# EasyEDA Pro project 3轴5.2_-专业软件格式.eprj, board 3轴5.2-PCB-V3.3
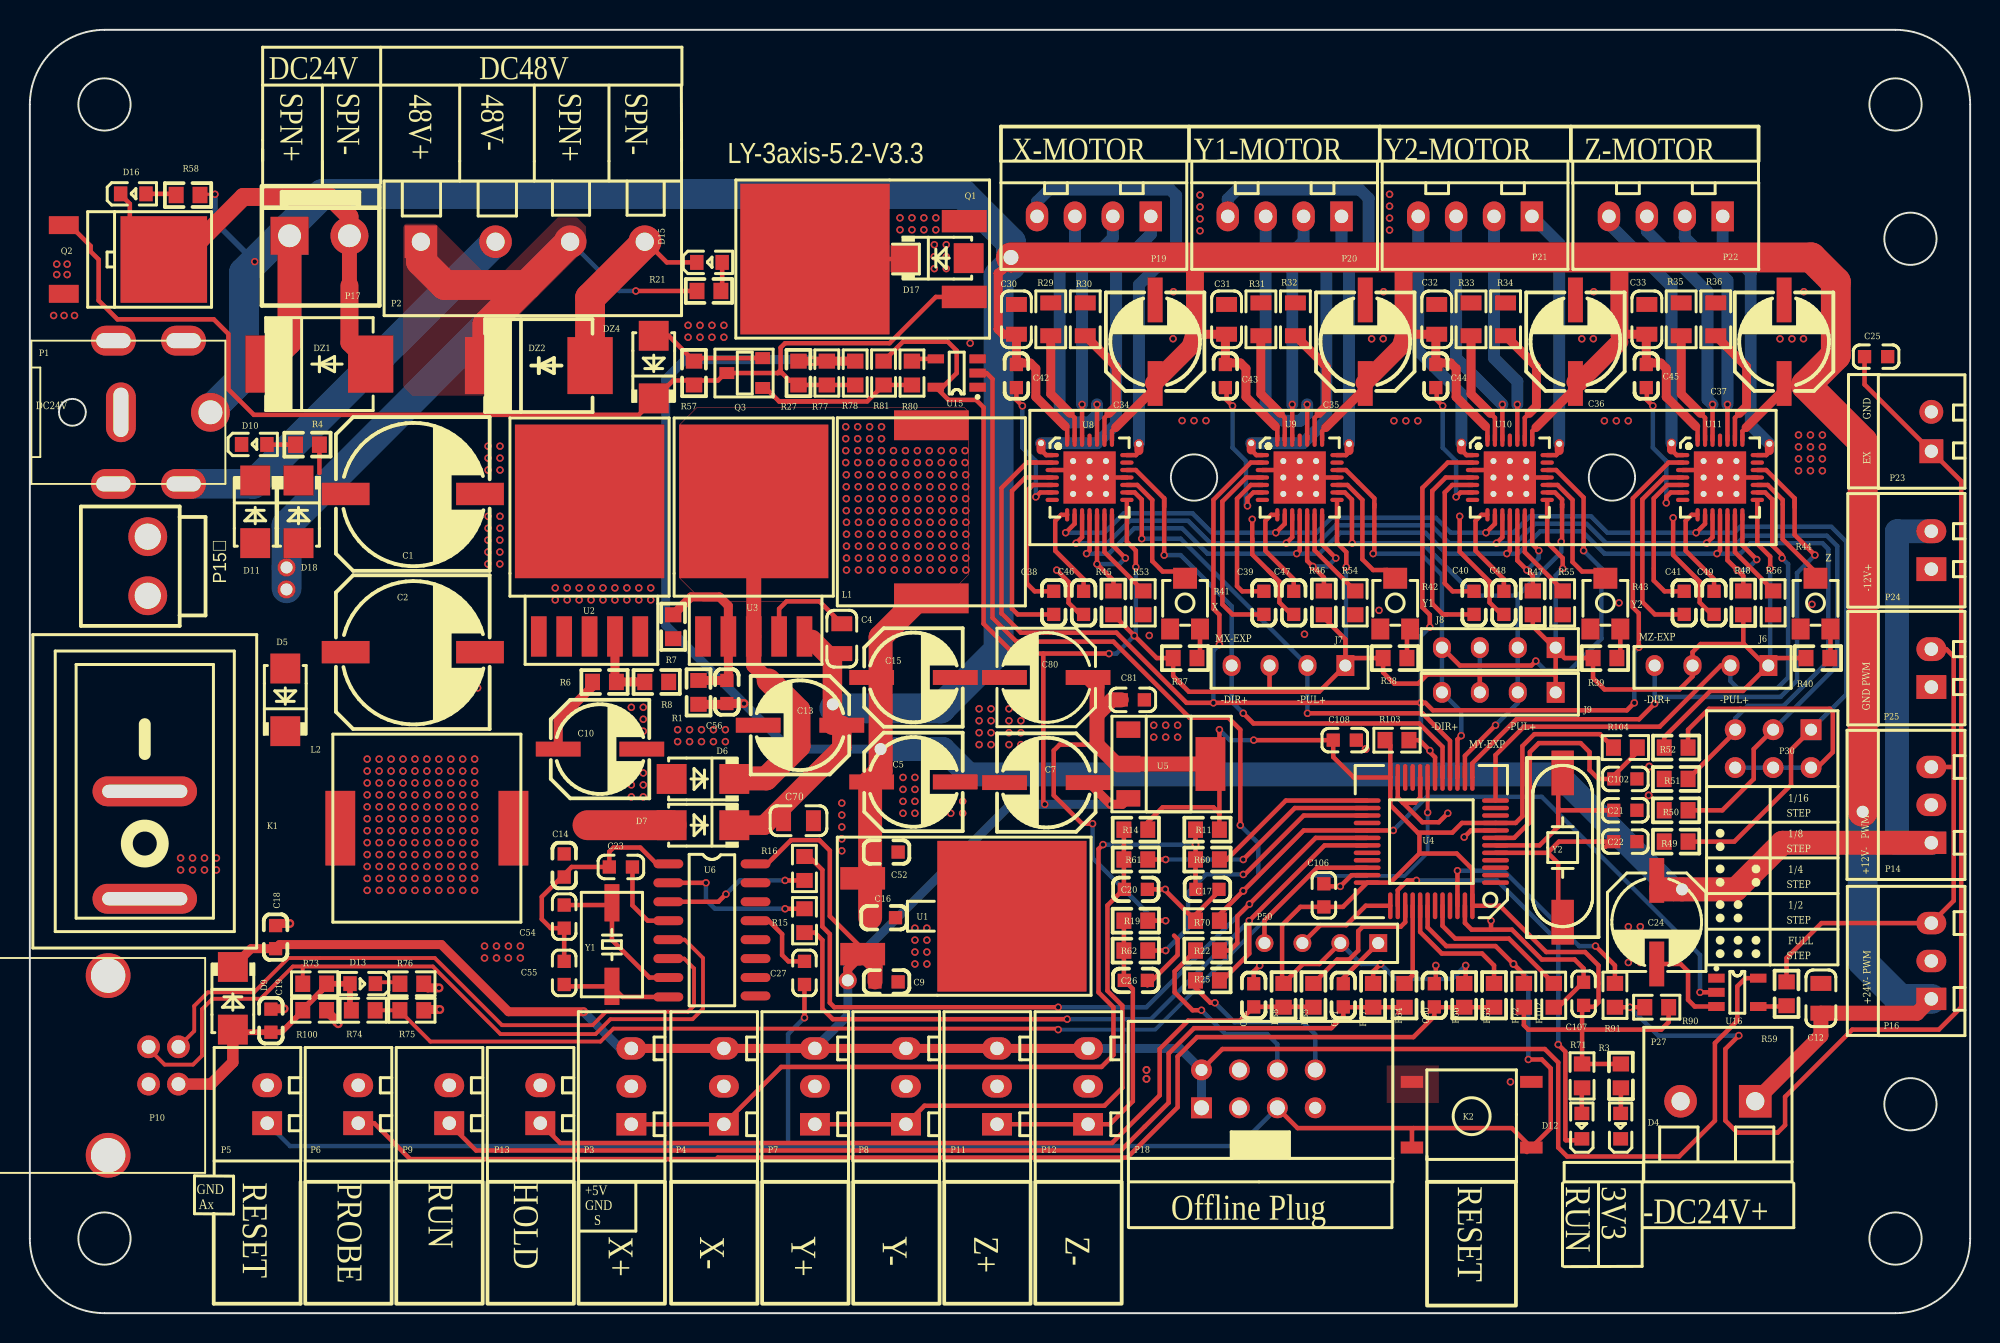
[diagram p2: board, top side]
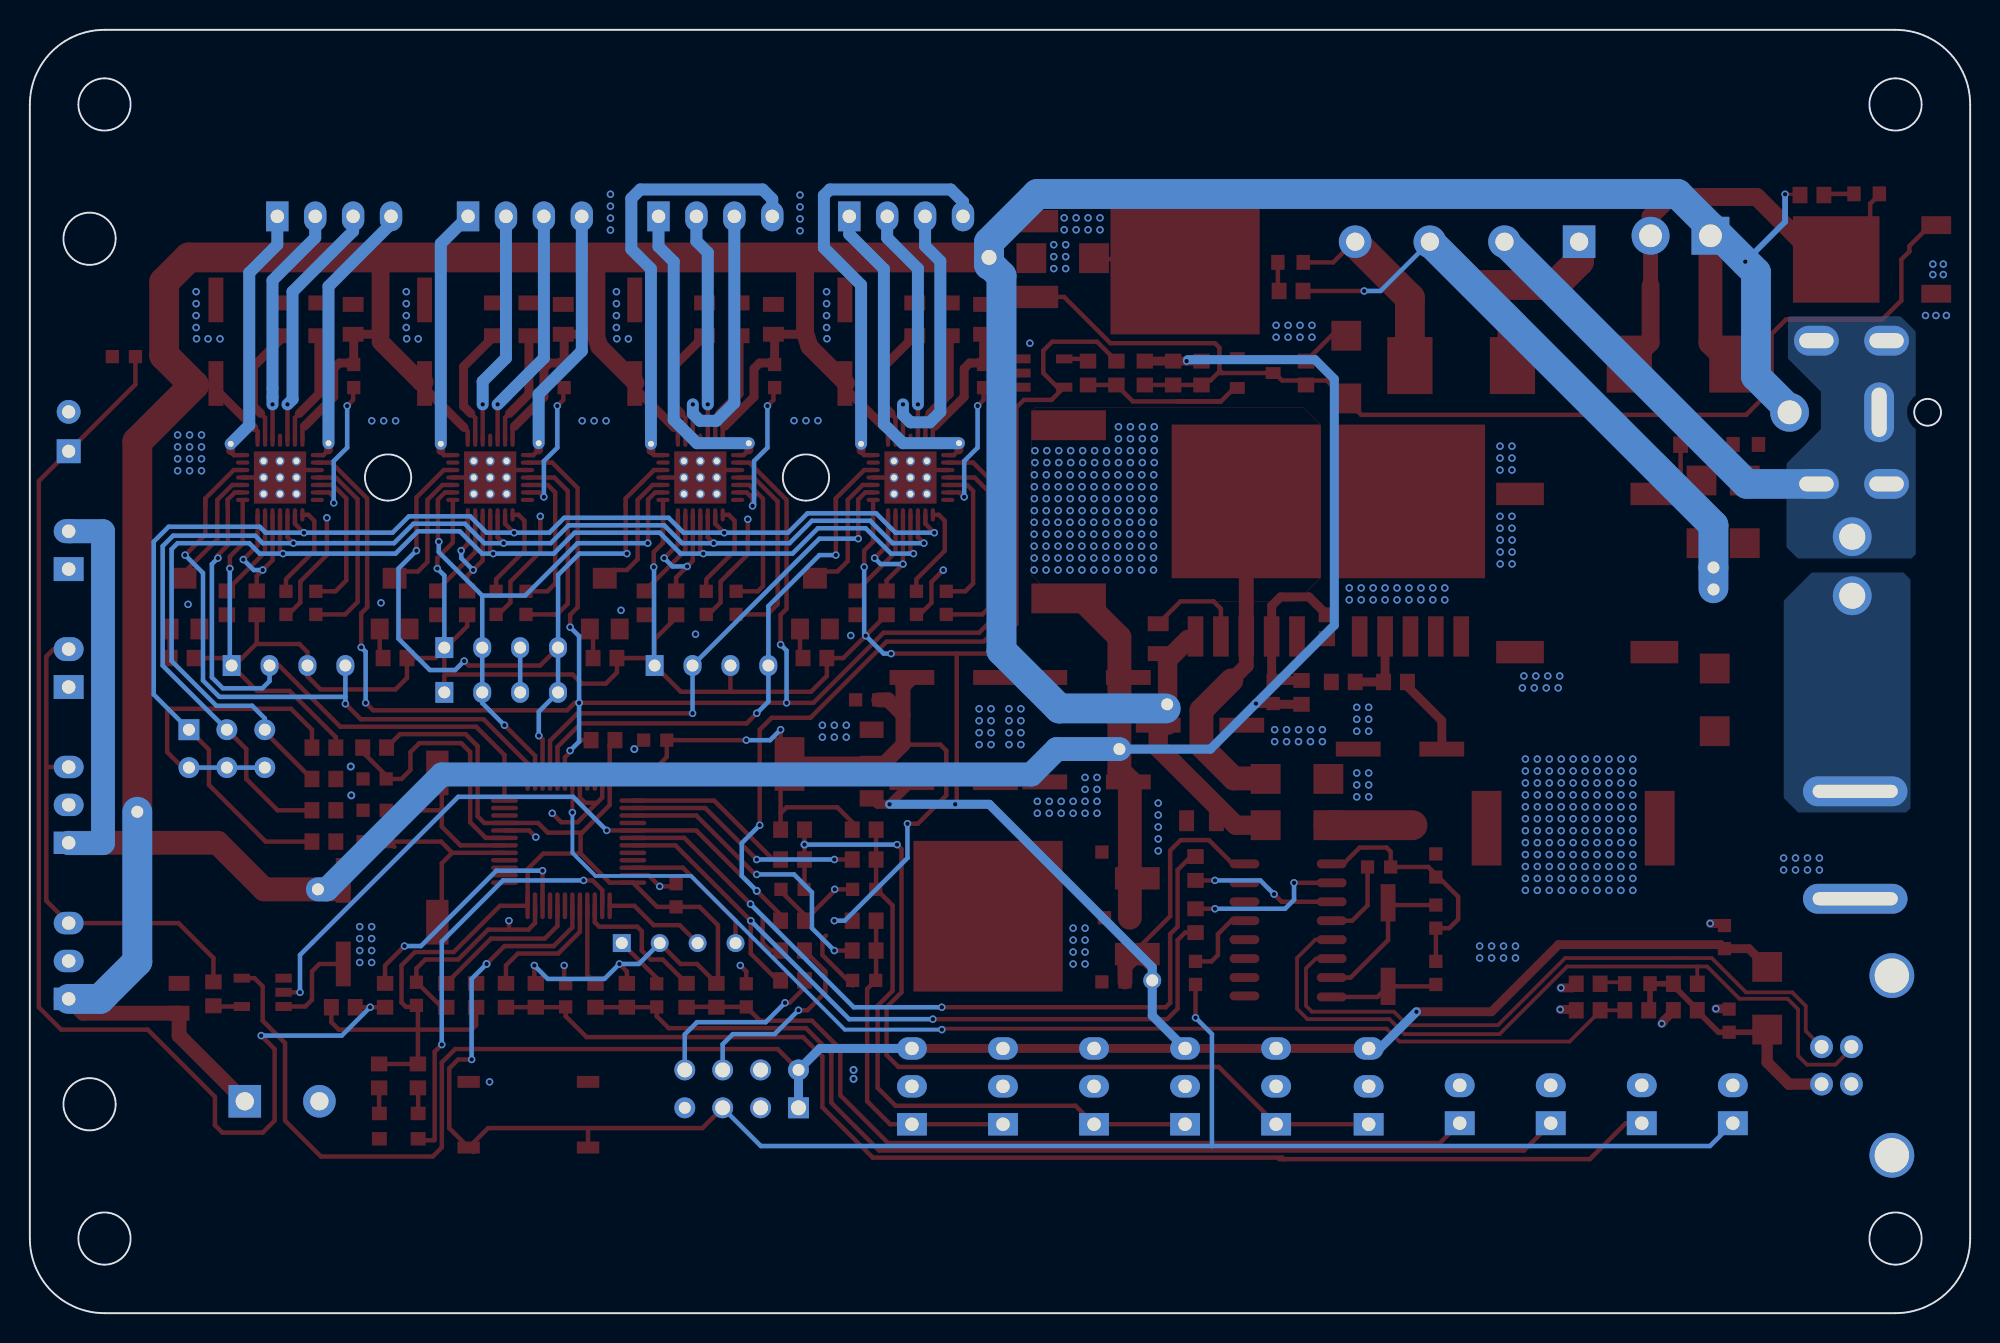
[diagram p3: board, bottom side, seen from below]

Outline 130 x 86 mm; copper layers: Top Layer, Bottom Layer. Coordinates in mm from the lower left corner of the outline.
Outline path: circle c5,81 r1.75 ; circle c5,5 r1.75 ; circle c78,56 r1.55 ; circle c106,56 r1.55 ; circle c125,81 r1.75 ; circle c125,5 r1.75 ; circle c126,72 r1.75 ; circle c126,14 r1.75 ; 0,81 0,5 arc(1.46,1.46) 5,0 125,0 arc(128.54,1.46) 130,5 130,81 arc(128.54,84.54) 125,86 5,86 arc(1.46,84.54) 0,81
Stack: Top Layer 0.0356mm / Dielectric1 0.32mm FR-4 er 4.8 / Bottom Layer 0.0356mm

## Design rules (mm)
net C24: Top Side Components
net R91: Top Side Components
net R90: Top Side Components
net P23: Top Side Components
net C25: Top Side Components
net R78: Top Side Components
net R77: Top Side Components
net D17: Top Side Components
net R56: Top Side Components
net R55: Top Side Components
net R54: Top Side Components
net R53: Top Side Components
net U16: Top Side Components
net U15: Top Side Components
net R104: Top Side Components
net R103: Top Side Components
net R102: Top Side Components
net R75: Top Side Components
net R74: Top Side Components
net R73: Top Side Components
net R72: Top Side Components
net R71: Top Side Components
net R70: Top Side Components
net P50: Top Side Components
net D4: Top Side Components
net C108: Top Side Components
net C107: Top Side Components
net C106: Top Side Components
net C22: Top Side Components
net C21: Top Side Components
net C102: Top Side Components
net C81: Top Side Components
net C80: Top Side Components
net C70: Top Side Components
net Y2: Top Side Components
net C52: Top Side Components
net C1: Top Side Components
net C2: Top Side Components
net C4: Top Side Components
net C5: Top Side Components
net C7: Top Side Components
net C9: Top Side Components
net C10: Top Side Components
net C12: Top Side Components
net C13: Top Side Components
net C14: Top Side Components
net C15: Top Side Components
net C16: Top Side Components
net C17: Top Side Components
net C18: Top Side Components
net C19: Top Side Components
net C20: Top Side Components
net C26: Top Side Components
net C30: Top Side Components
net C31: Top Side Components
net C32: Top Side Components
net C33: Top Side Components
net C34: Top Side Components
net C35: Top Side Components
net C36: Top Side Components
net C37: Top Side Components
net C38: Top Side Components
net C39: Top Side Components
net C40: Top Side Components
net C41: Top Side Components
net C42: Top Side Components
net C43: Top Side Components
net C44: Top Side Components
net C45: Top Side Components
net C46: Top Side Components
net C47: Top Side Components
net C48: Top Side Components
net C49: Top Side Components
net D5: Top Side Components
net D6: Top Side Components
net D7: Top Side Components
net D9: Top Side Components
net D10: Top Side Components
net D12: Top Side Components
net D13: Top Side Components
net D15: Top Side Components
net DZ1: Top Side Components
net DZ2: Top Side Components
net P24: Top Side Components
net P25: Top Side Components
net J6: Top Side Components
net J7: Top Side Components
net J8: Top Side Components
net K1: Top Side Components
net K2: Top Side Components
net L1: Top Side Components
net L2: Top Side Components
net P2: Top Side Components
net P3: Top Side Components
net P4: Top Side Components
net P5: Top Side Components
net P6: Top Side Components
net P7: Top Side Components
net P8: Top Side Components
net P9: Top Side Components
net P11: Top Side Components
net P12: Top Side Components
net P13: Top Side Components
net P14: Top Side Components
net P16: Top Side Components
net P17: Top Side Components
net P18: Top Side Components
net P19: Top Side Components
net P20: Top Side Components
net P21: Top Side Components
net P22: Top Side Components
net Q1: Top Side Components
net Q2: Top Side Components
net R1: Top Side Components
net R3: Top Side Components
net R4: Top Side Components
net R6: Top Side Components
net R7: Top Side Components
net R8: Top Side Components
net R11: Top Side Components
net R14: Top Side Components
net R19: Top Side Components
net R21: Top Side Components
net R22: Top Side Components
net R25: Top Side Components
net R27: Top Side Components
net R29: Top Side Components
net R30: Top Side Components
net R31: Top Side Components
net R32: Top Side Components
net R33: Top Side Components
net R34: Top Side Components
net R35: Top Side Components
net R36: Top Side Components
net R37: Top Side Components
net R38: Top Side Components
net R39: Top Side Components
net R40: Top Side Components
net R41: Top Side Components
net R42: Top Side Components
net R43: Top Side Components
net R44: Top Side Components
net R45: Top Side Components
net R46: Top Side Components
net R47: Top Side Components
net R48: Top Side Components
net R49: Top Side Components
net R50: Top Side Components
net R51: Top Side Components
net R52: Top Side Components
net U1: Top Side Components
net U2: Top Side Components
net U3: Top Side Components
net U4: Top Side Components
net U5: Top Side Components
net U8: Top Side Components
net U9: Top Side Components
net U10: Top Side Components
net U11: Top Side Components
net D16: Top Side Components
net DZ4: Top Side Components
net R57: Top Side Components
net R58: Top Side Components
net R59: Top Side Components
net J9: Top Side Components
net P27: Top Side Components
net C56: Top Side Components
net D11: Top Side Components
net P1: Top Side Components
net D18: Top Side Components
net C60: Top Side Components
net C61: Top Side Components
net C62: Top Side Components
net R60: Top Side Components
net R61: Top Side Components
net R62: Top Side Components
net R63: Top Side Components
net R64: Top Side Components
net R65: Top Side Components
net R66: Top Side Components
net R67: Top Side Components
net R68: Top Side Components
net P30: Top Side Components
net C23: Top Side Components
net C27: Top Side Components
net C54: Top Side Components
net C55: Top Side Components
net Q3: Top Side Components
net R15: Top Side Components
net R16: Top Side Components
net R80: Top Side Components
net R81: Top Side Components
net U6: Top Side Components
net Y1: Top Side Components
net R100: Top Side Components
net P10: Top Side Components
net P15: Top Side Components
net R76: Top Side Components
spacing Clearance (default): track to track 0.178, other pairs 0.178 to 0.178
spacing Polygon: track to track 0.508, other pairs 0.508 to 0.508
track width Width (default): min 0.01, default 0.254, max 5
differential pair DiffPairsRouting (default): width min 0.381, default 0.381, max 0.381; gap min 0.254, default 0.254
via RoutingVias (default): diameter min 0.3, default 0.8, max 1.27; hole min 0.3, default 0.6, max 2

## Placement (name value [footprint] x y rotation side)
C1  104  [电解电容贴片10x10]  25.4 54.8 0 top
C2  104  [电解电容贴片10x10]  25.4 44.2 0 top
C4  104  [0805C]  54.4 45.2 270 top
C5  18pF  [电解电容贴片6X6]  59.2 35.6 0 top
C7  104  [电解电容贴片6X6]  68.1 35.56 180 top
C9  100pF  [0603C]  57.4 22.2 180 top
C10  103  [电解电容贴片6X6]  38.2 37.8 0 top
C12  103  [0805C]  120 21.1 90 top
C13  103  [电解电容贴片6X6]  51.6 39.4 180 top
C14  104  [0603C]  35.8 30 90 top
C15  104  [电解电容贴片6X6]  59.2 42.6 0 top
C16  104  [0603C]  57.23 26.5 180 top
C17  103?  [0603C]  78.9 28.4 180 top
C18  104  [0603C]  16.46 25.2 270 top
C19  103  [0603C]  16.15 19.6 270 top
C20  103  [0603C]  74.1 28.4 180 top
C21  104  [0603C]  106.9 33.7 0 top
C22  100uF/35V  [0603C]  106.9 31.6 0 top
C23  100uF/35V  [0603C]  39.6 29.9 180 top
C24  104  [电解电容贴片6x6]  109 26.2 270 top
C25  100uF/35V  [0603C]  123.7 64.1 180 top
C26  100uF/35V  [0603C]  74.1 22.3 180 top
C27  100uF/35V  [0603C]  51.9 22.8 270 top
C30  100uF/35V  [0805C]  66.1 66.6 90 top
C31  100uF/63V  [0805C]  80.18 66.6 90 top
C32  100uF/63V  [0805C]  94.26 66.6 90 top
C33  100uF/35V  [0805C]  108.34 66.6 90 top
C34  105  [电解电容贴片6X6]  75.39 65.1 90 top
C35  104  [电解电容贴片6X6]  89.47 65.1 90 top
C36  105  [电解电容贴片6X6]  103.55 65.1 90 top
C37  100uF/35V  [电解电容贴片6X6]  117.53 65.1 90 top
C38  105  [0603C]  68.6 47.6 90 top
C39  33nF  [0603C]  82.68 47.6 90 top
C40  100uF/35V  [0603C]  96.76 47.6 90 top
C41  104  [0603C]  110.84 47.6 90 top
C42  100uF/35V  [0603C]  66.1 62.8 90 top
C43  104  [0603C]  80.1 62.8 90 top
C44  100uF/35V  [0603C]  94.2 62.8 90 top
C45  104  [0603C]  108.3 62.8 90 top
C46  104  [0603C]  70.6 47.6 270 top
C47  104  [0603C]  84.68 47.6 270 top
C48  100uF/35V  [0603C]  98.76 47.6 270 top
C49  100uF/35V  [0603C]  112.84 47.6 270 top
C52  104  [0603C]  57.4 30.9 180 top
C54  33pF  [0603C]  35.8 26.57 270 top
C55  33pF  [0603C]  35.8 22.8 90 top
C56  33nF  [0603C]  46.7 41.63 270 top
C60  103  [0603C]  94.1 21.3 270 top
C61  103  [0603C]  88 21.3 270 top
C62  103  [0603C]  82 21.3 270 top
C70  105  [0805C]  51.5 33 0 top
C80  100uF/35V  [电解电容贴片6x6]  68.1 42.6 180 top
C81  104  [0603C]  73.9 41.1 180 top
C102  104  [0603C]  106.9 35.8 180 top
C106  104  [0603C]  86.7 28 270 top
C107  104  [0603C]  104.1 21.4 270 top
C108  104  [0603C]  88.1 38.4 180 top
D4  SS56  [0603LED]  106.6 12.5 270 top
D5  绿光  [SMA]  17.11 41.1 90 top
D6  1N4738A/8.2V  [SMA]  45.1 35.8 180 top
D7  绿光  [SMA]  45.1 32.7 180 top
D9  1N4738A/8.2V  [SMA]  13.6 21.1 270 top
D10  绿光  [0603LED]  15 58.2 180 top
D11  4148  [SMA]  15.1 53.7 270 top
D12  ESD05V52D-C  [0603LED]  104 12.5 270 top
D13  SS56  [0603LED]  22.33 22.1 0 top
D15  SS56  [0603LED]  45.5 70.4 180 top
D16  红光  [0603LED]  6.9 74.99 180 top
D17  SS56  [SMA]  60.8 70.7 0 top
D18  红光  [SMA]  18 53.7 270 top
DZ1  快恢复二极管RS2M  [SMC]  19.4 63.6 0 top
DZ2  快恢复二极管RS2M  [SMC]  34.1 63.5 0 top
DZ4  稳压二极管SMAZ10V  [SMA]  41.8 63.4 90 top
J6  4P  [SIP4#2]  116.48 43.4 180 top
J7  4P  [SIP4#2]  88.14 43.4 180 top
J8  4P  [SIP4#2]  102.23 44.6 180 top
J9  4P  [SIP4#2]  102.23 41.6 180 top
K1  开关按键  [船型开关KCD1-101]  7.7 34.97 180 top
K2  按键  [按键6x6贴片]  96.6 13.3 270 top
L1  47uH/5A  [电感贴片12X12]  60.4 53.7 270 top
L2  47uH/5A  [电感贴片12X12]  26.6 32.5 0 top
NOREF  -  [Pad_ie80]  100.26 56 0 top
NOREF#2  -  [Pad_ie87]  112.14 54.9 180 top
NOREF#3  -  [Pad_ie59]  71 56 270 top
NOREF#4  -  [Pad_ie65]  83.98 54.9 180 top
NOREF#5  -  [Pad_ie98]  65.73 70.75 0 top
NOREF#6  -  [Pad_ie95]  113.24 57.1 0 top
NOREF#7  -  [Pad_ie76]  98.06 54.9 180 top
NOREF#8  -  [Pad_ie86]  95.91 58.3 0 top
NOREF#9  -  [Pad_ie61]  69.9 56 180 top
NOREF#10  -  [Pad_ie53]  53.8 40.8 0 top
NOREF#11  -  [Pad_ie72]  86.18 57.1 0 top
NOREF#12  -  [Pad_ie83]  100.26 57.1 0 top
NOREF#13  -  [Pad_ie90]  112.14 56 180 top
NOREF#14  -  [Pad_ie101]  110.7 28.4 0 top
NOREF#15  -  [Pad_ie100]  54.8 22.3 0 top
NOREF#16  -  [Pad_ie99]  57 37.8 0 top
NOREF#17  -  [Pad_ie52]  17.2 49.97 0 top
NOREF#18  -  [Pad_ie54]  67.75 58.3 0 top
NOREF#19  -  [Pad_ie89]  113.24 54.9 270 top
NOREF#20  -  [Pad_ie92]  113.24 56 270 top
NOREF#21  -  [Pad_ie79]  98.06 56 180 top
NOREF#22  -  [Pad_ie82]  98.06 57.1 180 top
NOREF#23  -  [Pad_ie70]  85.08 56 270 top
NOREF#24  -  [Pad_ie78]  99.16 54.9 270 top
NOREF#25  -  [Pad_ie57]  72.1 57.1 0 top
NOREF#26  -  [Pad_ie74]  88.39 58.26 0 top
NOREF#27  -  [Pad_ie68]  83.98 56 180 top
NOREF#28  -  [Pad_ie84]  99.16 57.1 0 top
NOREF#29  -  [Pad_ie60]  72.1 56 0 top
NOREF#30  -  [Pad_ie96]  116.55 58.26 0 top
NOREF#31  -  [Pad_ie88]  114.34 54.9 0 top
NOREF#32  -  [Pad_ie71]  83.98 57.1 180 top
NOREF#33  -  [Pad_ie73]  85.08 57.1 0 top
NOREF#34  -  [Pad_ie81]  99.16 56 270 top
NOREF#35  -  [Pad_ie103]  17.19 48.5 0 top
NOREF#36  -  [Pad_ie85]  102.47 58.26 0 top
NOREF#37  -  [Pad_ie58]  69.9 57.1 180 top
NOREF#38  -  [Pad_ie94]  114.34 57.1 0 top
NOREF#39  -  [Pad_ie67]  85.08 54.9 270 top
NOREF#40  -  [Pad_ie64]  69.9 54.9 180 top
NOREF#41  -  [Pad_ie75]  81.83 58.3 0 top
NOREF#42  -  [Pad_ie91]  114.34 56 0 top
NOREF#43  -  [Pad_ie93]  112.14 57.1 180 top
NOREF#44  -  [Pad_ie62]  71 54.9 270 top
NOREF#45  -  [Pad_ie66]  86.18 54.9 0 top
NOREF#46  -  [Pad_ie56]  71 57.1 0 top
NOREF#47  -  [Pad_ie69]  86.18 56 0 top
NOREF#48  -  [Pad_ie77]  100.26 54.9 0 top
NOREF#49  -  [Pad_ie63]  72.1 54.9 0 top
NOREF#50  -  [Pad_ie55]  74.31 58.26 0 top
NOREF#51  -  [Pad_ie97]  109.99 58.3 0 top
NOREF#52  -  [Pad_ie102]  122.8 33.6 0 top
P1  -  [DC007B]  0.1 60.37 180 top
P2  USB座TYPE-C-16P  [直插座4P-KF300]  26.2 71.8 0 top
P3  4P  [HDR1X3_CON]  40.3 15.2 90 top
P4  KF300  [HDR1X3_CON]  46.5 15.2 90 top
P5  4P  [HDR1X2_CON#2]  15.9 14 90 top
P6  KF300  [HDR1X2_CON#2]  22 14 90 top
P7  8P  [HDR1X3_CON]  52.6 15.2 90 top
P8  4P  [HDR1X3_CON]  58.7 15.2 90 top
P9  4P  [HDR1X2_CON#2]  28.1 14 90 top
P10  2P  [USB_TYPEB]  7.6 16.6 270 top
P11  3P  [HDR1X3_CON]  64.8 15.2 90 top
P12  3P  [HDR1X3_CON]  70.9 15.2 90 top
P13  4P  [HDR1X2_CON#2]  34.2 14 90 top
P14  2P  [HDR1X3_CON]  127.4 34.06 90 top
P15  2P-3.96  [2P-P3.96]  7.9 50.06 270 top
P16  3P  [HDR1X3_CON]  127.4 23.6 90 top
P17  2P  [VH3.96-2P直插座]  19.55 73.04 180 top
P18  2P  [IDC8]  82.31 14.78 0 top
P19  2P  [HDR1X4_CON]  75.1 73.5 180 top
P20  4P  [HDR1X4_CON]  87.88 73.5 180 top
P21  4P  [HDR1X4_CON]  100.64 73.5 180 top
P22  2P  [HDR1X4_CON]  113.42 73.5 180 top
P23  2P  [HDR1X2_CON]  127.4 59.08 90 top
P24  2P红色  [HDR1X2_CON#2]  127.4 51.13 90 top
P25  2P  [HDR1X2_CON#2]  127.4 43.23 90 top
P27  2P红色  [直插座2P-KF300]  115.6 14.2 180 top
P30  KF300  [HDR2X3]  119.34 39.1 180 top
P50  -  [SIP4]  90.34 24.8 180 top
Q1  F50N06 (FR9024N)  [TO-263-2]  62.6 70.64 0 top
Q2  AO3401  [TO-252]  4.87 70.61 270 top
Q3  F50N06 (FR9024N)  [SOT-23]  47.9 63 90 top
R1  1K!!  [0603R]  44.8 41.6 270 top
R3  1.8K  [0603R]  106.6 15.9 270 top
R4  1K  [0603R]  18.6 58.2 0 top
R6  680!!  [0603R]  38.5 42.3 180 top
R7  100  [0603R]  43.1 46 90 top
R8  10K  [0603R]  42 42.3 180 top
R11  100  [0603R]  78.9 32.4 0 top
R14  10K  [0603R]  74.1 32.4 0 top
R15  0Ω  [0603R]  51.9 26.3 270 top
R16  10K/NC  [0603R]  51.9 29.8 90 top
R19  100  [0603R]  74.1 26.3 0 top
R21  10K  [0603R]  45.5 68.5 0 top
R22  0Ω  [0603R]  78.9 24.3 180 top
R25  1K  [0603R]  78.9 22.3 180 top
R27  1K  [0603R]  51.5 63 90 top
R29  10K  [0805R]  68.4 66.6 90 top
R30  100  [0805R]  70.71 66.6 270 top
R31  0Ω  [0805R]  82.48 66.6 90 top
R32  10K  [0805R]  84.79 66.6 270 top
R33  100  [0805R]  96.56 66.6 90 top
R34  10K  [0805R]  98.87 66.6 270 top
R35  0.1  [0805R]  110.64 66.6 90 top
R36  0Ω  [0805R]  112.95 66.6 270 top
R37  10K  [0603R]  77.4 43.9 180 top
R38  100  [0603R]  91.47 43.9 180 top
R39  10K  [0603R]  105.53 43.9 180 top
R40  20K  [0603R]  119.8 43.9 180 top
R41  10K  [松下贴片电位器3x3]  77.4 47.6 0 top
R42  10K  [松下贴片电位器3x3]  91.48 47.6 0 top
R43  10K  [松下贴片电位器3x3]  105.56 47.6 0 top
R44  10K  [松下贴片电位器3x3]  119.64 47.6 0 top
R45  0Ω  [0603R]  72.6 47.6 90 top
R46  0Ω  [0603R]  86.7 47.6 90 top
R47  1K  [0603R]  100.7 47.6 90 top
R48  10K  [0603R]  114.8 47.6 90 top
R49  10K  [0603R]  110.3 31.6 180 top
R50  2k  [0603R]  110.3 33.7 180 top
R51  5.1K  [0603R]  110.3 35.8 180 top
R52  100  [0603R]  110.3 37.9 0 top
R53  100  [0603R]  74.6 47.6 90 top
R54  0Ω  [0603R]  88.8 47.6 90 top
R55  10K  [0603R]  102.7 47.6 90 top
R56  0Ω  [0603R]  116.8 47.6 90 top
R57  10  [0603R]  44.5 63 90 top
R58  4.7K  [0603R]  10.6 74.93 180 top
R59  2K  [0603R]  117.7 21.4 90 top
R60  10K  [0603R]  78.9 30.4 180 top
R61  100  [0603R]  74.1 30.4 180 top
R62  100  [0603R]  74.1 24.3 180 top
R63  10K  [0603R]  98.1 21.3 270 top
R64  2K  [0603R]  92.1 21.3 270 top
R65  2k  [0603R]  86 21.3 270 top
R66  5.1K  [0603R]  96.1 21.3 90 top
R67  100  [0603R]  90 21.3 90 top
R68  10  [0603R]  84 21.3 90 top
R70  44.2K  [0603R]  78.9 26.3 0 top
R71  2.37K  [0603R]  104 15.9 90 top
R72  16K  [0603R]  100.1 21.3 90 top
R73  1.8K  [0603R]  19.08 22.07 180 top
R74  1K  [0603R]  22.34 20.29 0 top
R75  1.8K  [0603R]  25.59 20.29 0 top
R76  1K  [0603R]  25.59 22.07 180 top
R77  1K  [0603R]  53.4 63 90 top
R78  1K  [0603R]  55.3 63 90 top
R80  100  [0603R]  59.1 63 270 top
R81  10K  [0603R]  57.2 63 90 top
R90  10K  [0603R]  109 20.5 0 top
R91  100  [0603R]  106.2 21.3 270 top
R100  1K!!  [0603R]  19.08 20.3 180 top
R102  10k  [0603R]  102.1 21.3 90 top
R103  -  [0603R]  91.6 38.4 180 top
R104  10k  [0603R]  106.9 37.9 0 top
U1  74LVC1G17  [TO-263-2]  55.8 26.6 180 top
U2  CH340G  [TO-263]  37.5 49.87 0 top
U3  74LVC1G17  [TO-263]  48.5 49.87 0 top
U4  74LVC1G17  [LQFP48]  93.9 31.6 180 top
U5  74LVC1G17  [SOT-223]  76.3 36.8 270 top
U6  STM32F103C8T6/CBT6  [SOP16]  45.7 26.3 0 top
U8  HR4988SQ  [QFN28]  71.26 55.9 270 top
U9  74LVC1G17  [QFN28]  85.34 55.9 270 top
U10  74LVC1G17  [QFN28]  99.42 55.9 270 top
U11  HR4988SQ  [QFN28]  113.5 55.9 270 top
U15  74LVC1G04  [SOT-23-5]  62.1 63 180 top
U16  EL357N/PC817  [SOT-23-5]  114.4 21.5 0 top
Y1  12M  [晶振贴片49SSMD]  39 24.7 90 top
Y2  8M  [晶振贴片]  102.7 31.2 90 top

## Footprints (pads in the part's own frame, mm; a bottom-side part is the same pattern mirrored in y, then rotated)
2P-P3.96
  round 2.6 hole 1.75: 1(-1.98,0) 2(1.98,0)
0603C
  rect 0.889x0.889 smd: 1(-0.774,0) 2(0.774,0)
0603LED
  rect 0.9x1 smd: 1(-0.884,-0.017) 2(0.816,-0.017)
0603R
  rect 1x1.1 smd: 1(-0.8,0) 2(0.8,0)
0805C
  rect 1x1.4 smd: 1(-1,0) 2(1,0)
0805R
  rect 1x1.4 smd: 1(-1.1,0) 2(1.1,0)
DC007B
  round 2.6 hole 1.6: 1(-12,0)
  oval 2x4 hole 1x3.3: 2(-6,0)
  oval 3x2 hole 2.3x1: 3(-5.5,4.8) 4(-10.2,4.8) 5(-5.5,-4.8) 6(-10.2,-4.8)
HDR1X2_CON
  rect 1.6x1.6 hole 0.88: 1(-1.32,0)
  round 1.6 hole 0.88: 2(1.32,0)
HDR1X2_CON#2
  rect 1.6x2 hole 0.9: 1(-1.27,0)
  oval 1.6x2 hole 0.9: 2(1.27,0)
HDR1X3_CON
  rect 1.5x2 hole 0.9: 1(-2.54,0)
  oval 1.5x2 hole 0.9: 2(0,0) 3(2.54,0)
HDR1X4_CON
  rect 1.5x2 hole 0.9: 1(0,0)
  oval 1.5x2 hole 0.9: 2(2.54,0) 3(5.08,0) 4(7.62,0)
HDR2X3
  rect 1.4x1.4 hole 0.8: 1(0,0)
  round 1.4 hole 0.8: 2(0,2.54) 3(2.54,0) 4(2.54,2.54) 5(5.08,0) 6(5.08,2.54)
IDC8
  rect 1.4x1.4 hole 1: 1(-3.812,-1.019)
  round 1.4 hole 0.8: 2(-3.812,1.521) 7(3.808,-1.019)
  round 1.4 hole 1: 3(-1.272,-1.019) 4(-1.272,1.521) 5(1.268,-1.019) 6(1.268,1.521) 8(3.808,1.521)
LQFP48
  oval 1.8x0.3 smd: 1(-4.3,2.75) 2(-4.3,2.25) 3(-4.3,1.75) 4(-4.3,1.25) 5(-4.3,0.75) 6(-4.3,0.25) 7(-4.3,-0.25) 8(-4.3,-0.75) 9(-4.3,-1.25) 10(-4.3,-1.75) 11(-4.3,-2.25) 12(-4.3,-2.75) 25(4.3,-2.75) 26(4.3,-2.25) 27(4.3,-1.75) 28(4.3,-1.25) 29(4.3,-0.75) 30(4.3,-0.25) 31(4.3,0.25) 32(4.3,0.75) 33(4.3,1.25) 34(4.3,1.75) 35(4.3,2.25) 36(4.3,2.75)
  oval 0.3x1.8 smd: 13(-2.75,-4.3) 14(-2.25,-4.3) 15(-1.75,-4.3) 16(-1.25,-4.3) 17(-0.75,-4.3) 18(-0.25,-4.3) 19(0.25,-4.3) 20(0.75,-4.3) 21(1.25,-4.3) 22(1.75,-4.3) 23(2.25,-4.3) 24(2.75,-4.3) 37(2.75,4.3) 38(2.25,4.3) 39(1.75,4.3) 40(1.25,4.3) 41(0.75,4.3) 42(0.25,4.3) 43(-0.25,4.3) 44(-0.75,4.3) 45(-1.25,4.3) 46(-1.75,4.3) 47(-2.25,4.3) 48(-2.75,4.3)
Pad_ie52
  round 1.2 hole 0.8: 1(0,0)
Pad_ie53
  round 1.2 hole 0.8: 1(0,0)
Pad_ie54
  round 0.6 hole 0.4: 0(0,0)
Pad_ie55
  round 0.6 hole 0.4: 3(0,0)
Pad_ie56
  round 0.6 hole 0.4: 4(0,0)
Pad_ie57
  round 0.6 hole 0.4: 5(0,0)
Pad_ie58
  round 0.6 hole 0.4: 5(0,0)
Pad_ie59
  round 0.6 hole 0.4: 5(0,0)
Pad_ie60
  round 0.6 hole 0.4: 5(0,0)
Pad_ie61
  round 0.6 hole 0.4: 5(0,0)
Pad_ie62
  round 0.6 hole 0.4: 5(0,0)
Pad_ie63
  round 0.6 hole 0.4: 5(0,0)
Pad_ie64
  round 0.6 hole 0.4: 5(0,0)
Pad_ie65
  round 0.6 hole 0.4: 5(0,0)
Pad_ie66
  round 0.6 hole 0.4: 5(0,0)
Pad_ie67
  round 0.6 hole 0.4: 5(0,0)
Pad_ie68
  round 0.6 hole 0.4: 5(0,0)
Pad_ie69
  round 0.6 hole 0.4: 5(0,0)
Pad_ie70
  round 0.6 hole 0.4: 5(0,0)
Pad_ie71
  round 0.6 hole 0.4: 5(0,0)
Pad_ie72
  round 0.6 hole 0.4: 5(0,0)
Pad_ie73
  round 0.6 hole 0.4: 4(0,0)
Pad_ie74
  round 0.6 hole 0.4: 3(0,0)
Pad_ie75
  round 0.6 hole 0.4: 0(0,0)
Pad_ie76
  round 0.6 hole 0.4: 5(0,0)
Pad_ie77
  round 0.6 hole 0.4: 5(0,0)
Pad_ie78
  round 0.6 hole 0.4: 5(0,0)
Pad_ie79
  round 0.6 hole 0.4: 5(0,0)
Pad_ie80
  round 0.6 hole 0.4: 5(0,0)
Pad_ie81
  round 0.6 hole 0.4: 5(0,0)
Pad_ie82
  round 0.6 hole 0.4: 5(0,0)
Pad_ie83
  round 0.6 hole 0.4: 5(0,0)
Pad_ie84
  round 0.6 hole 0.4: 4(0,0)
Pad_ie85
  round 0.6 hole 0.4: 3(0,0)
Pad_ie86
  round 0.6 hole 0.4: 0(0,0)
Pad_ie87
  round 0.6 hole 0.4: 5(0,0)
Pad_ie88
  round 0.6 hole 0.4: 5(0,0)
Pad_ie89
  round 0.6 hole 0.4: 5(0,0)
Pad_ie90
  round 0.6 hole 0.4: 5(0,0)
Pad_ie91
  round 0.6 hole 0.4: 5(0,0)
Pad_ie92
  round 0.6 hole 0.4: 5(0,0)
Pad_ie93
  round 0.6 hole 0.4: 5(0,0)
Pad_ie94
  round 0.6 hole 0.4: 5(0,0)
Pad_ie95
  round 0.6 hole 0.4: 4(0,0)
Pad_ie96
  round 0.6 hole 0.4: 3(0,0)
Pad_ie97
  round 0.6 hole 0.4: 0(0,0)
Pad_ie98
  round 1.6 hole 1: 0(0,0)
Pad_ie99
  round 1.2 hole 0.8: 1(0,0)
Pad_ie100
  round 1.2 hole 0.8: 1(0,0)
Pad_ie101
  round 1.2 hole 0.8: 1(0,0)
Pad_ie102
  round 1.2 hole 0.8: 1(0,0)
Pad_ie103
  round 1.2 hole 0.8: 1(0,0)
QFN28
  oval 0.28x0.895 smd: 1(-1.601,-2.756) 2(-1.101,-2.756) 3(-0.601,-2.756) 4(-0.1,-2.756) 5(0.401,-2.756) 6(0.9,-2.756) 7(1.401,-2.756) 15(1.401,2.244) 16(0.9,2.244) 17(0.401,2.244) 18(-0.1,2.244) 19(-0.601,2.244) 20(-1.101,2.244) 21(-1.601,2.244)
  oval 0.895x0.28 smd: 8(2.4,-1.758) 9(2.4,-1.257) 10(2.4,-0.756) 11(2.4,-0.256) 12(2.4,0.244) 13(2.4,0.745) 14(2.4,1.245) 22(-2.6,1.245) 23(-2.6,0.745) 24(-2.6,0.244) 25(-2.6,-0.256) 26(-2.6,-0.756) 27(-2.6,-1.257) 28(-2.6,-1.758)
  rect 3.5x3.5 smd: 29(-0.1,-0.256)
SIP4
  rect 1.2x1.2 hole 0.8: 1(0,0)
  round 1.2 hole 0.8: 2(2.54,0) 3(5.08,0) 4(7.62,0)
SIP4#2
  rect 1.2x1.4 hole 0.8: 1(0,0)
  oval 1.2x1.4 hole 0.8: 2(2.54,0) 3(5.08,0) 4(7.62,0)
SMA
  rect 2x2 smd: 1(2.1,0) 2(-2.1,0)
SMC
  rect 3.03x3.82 smd: 1(3.435,0) 2(-3.435,0)
SOP16
  oval 2x0.6 smd: 1(-2.921,3.81) 2(-2.921,2.54) 3(-2.921,1.27) 4(-2.921,0) 5(-2.921,-1.27) 6(-2.921,-2.54) 7(-2.921,-3.81) 8(-2.921,-5.11) 9(2.921,-5.04) 10(2.921,-3.81) 11(2.921,-2.54) 12(2.921,-1.27) 13(2.921,0) 14(2.921,1.27) 15(2.921,2.54) 16(2.921,3.81)
SOT-23
  rect 0.8x1 smd: 1(-1,-1.2) 2(0,1.2) 3(1,-1.2)
SOT-23-5
  rect 1.1x0.6 smd: 1(-1.4,0.95) 2(-1.4,0) 3(-1.4,-0.95) 4(1.4,-0.95) 5(1.4,0.95)
SOT-223
  rect 1.1x1.6 smd: 1(-2.3,-2.7) 2(0,-2.7) 3(2.3,-2.7)
  rect 3.6x2 smd: 4(0,2.8)
TO-252
  rect 1.2x2 smd: 1(-2.3,-2.6) 3(2.3,-2.6)
  rect 5.8x5.8 smd: 2(0,4.1)
TO-263
  rect 1.05x2.7 smd: 1(-3.4,-4.526) 2(-1.7,-4.526) 3(0,-4.526) 4(1.7,-4.526) 5(3.4,-4.526)
  rect 10x10.3 smd: 3(0,4.526)
TO-263-2
  rect 3x1.5 smd: 1(0,-2.54) 3(0,2.54)
  rect 10x10.1 smd: 2(-10,0)
USB_TYPEB
  round 1.524 hole 0.92: 1(1.25,2.355) 2(-1.25,2.355) 3(-1.25,0.355) 4(1.25,0.355)
  round 3 hole 2.3: 5(-6.02,-2.355) 6(6.02,-2.355)
VH3.96-2P直插座
  rect 2.54x2.54 hole 1.524: 1(2.151,0.84)
  round 2.54 hole 1.524: 2(-1.863,0.84)
按键6x6贴片
  rect 0.8x1.5 smd: 1(2.2,4) 2(-2.2,4) 3(2.2,-4) 4(-2.2,-4)
晶振贴片
  rect 3x1.5 smd: 1(-5,0) 2(5,0)
晶振贴片49SSMD
  rect 2.5x1 smd: 1(-2.8,0) 2(2.8,0)
松下贴片电位器3x3
  rect 1.2x1.4 smd: 1(-1,-1.75) 3(1,-1.75)
  rect 1.6x1.4 smd: 2(0,1.65)
电感贴片12X12
  rect 2x5 smd: 1(-5.8,0) 2(5.8,0)
电解电容贴片6X6
  rect 3x1 smd: 1(-2.8,0) 2(2.8,0)
电解电容贴片6x6
  rect 3x1 smd: 1(-2.8,0) 2(2.8,0)
电解电容贴片10x10
  rect 3.2x1.5 smd: 1(-4.242,0.097) 2(4.758,0.097)
直插座2P-KF300
  rect 2.184x2.184 hole 1.219: 1(0,0)
  round 2.184 hole 1.219: 2(5,0)
直插座4P-KF300
  rect 2.184x2.184 hole 1.219: 1(0,0)
  round 2.184 hole 1.219: 2(5,0) 3(10,0) 4(15,0)
船型开关KCD1-101
  oval 7x2 hole 5.7x0.88: 1(0,0) 2(0,7.2)

## Nets
3V3: C80.1 C81.2 C106.2 C107.2 C108.2 P50.2 R3.1 R11.2 R14.2 R19.2 R66.2 R67.2 R68.2 R71.2 R72.1 R90.2 R103.2 R104.1 U4.9 U4.24 U4.36 U4.48 U5.2 U5.4
12V: C5.1 C15.1 C16.2 C24.1 C52.2 C56.2 L1.2 NOREF#14.1 NOREF#16.1 P14.1 P24.2 R1.2 R27.2 R77.2 R78.2 U1.1
24V: C4.2 C12.1 C13.1 C30.1 C31.1 C32.1 C33.1 C34.1 C35.1 C36.1 C37.1 C42.2 C43.2 C44.2 C45.2 C70.1 D7.2 DZ1.2 NOREF#5.0 NOREF#10.1 NOREF#52.1 P1.1 P16.1 P17.1 P27.1 R58.1 U3.5 U8.22 U8.28 U9.22 U9.28 U10.22 U10.28 U11.22 U11.28
48V1: C1.1 C2.1 D11.2 D18.2 R4.2 U2.1
48V_IN: D11.1 D18.1 DZ2.2 NOREF#17.1 NOREF#35.1 P2.1 P2.3 R21.1
48V_SPN-: D15.2 D17.2 DZ2.1 P2.4 Q1.2
GND: C1.2 C2.2 C5.2 C7.2 C9.1 C10.2 C12.2 C13.2 C14.1 C15.2 C16.1 C17.1 C18.1 C19.1 C20.1 C21.2 C22.2 C23.2 C24.2 C25.1 C26.1 C30.2 C31.2 C32.2 C33.2 C34.2 C35.2 C36.2 C37.2 C46.2 C47.2 C48.2 C49.2 C52.1 C54.2 C55.2 C60.1 C61.1 C62.1 C70.2 C80.2 C81.1 C102.1 C106.1 C107.1 C108.1 D4.2 D5.1 D6.1 D10.2 D17.1 DZ4.1 K1.2 K2.2 K2.4 NOREF.5 NOREF#2.5 NOREF#3.5 NOREF#4.5 NOREF#6.4 NOREF#7.5 NOREF#9.5 NOREF#11.5 NOREF#12.5 NOREF#13.5 NOREF#19.5 NOREF#20.5 NOREF#21.5 NOREF#22.5 NOREF#23.5 NOREF#24.5 NOREF#25.5 NOREF#27.5 NOREF#28.4 NOREF#29.5 NOREF#31.5 NOREF#32.5 NOREF#33.4 NOREF#34.5 NOREF#37.5 NOREF#38.5 NOREF#39.5 NOREF#40.5 NOREF#42.5 NOREF#43.5 NOREF#44.5 NOREF#45.5 NOREF#46.4 NOREF#47.5 NOREF#48.5 NOREF#49.5 P3.2 P4.2 P5.2 P6.2 P7.2 P8.2 P9.2 P10.4 P10.5 P10.6 P11.2 P12.2 P13.2 P14.2 P16.2 P18.3 P18.4 P23.2 P24.1 P25.1 P27.2 P50.1 Q1.3 Q2.3 Q3.3 R7.1 R8.1 R29.2 R30.1 R31.2 R32.1 R33.2 R34.1 R35.2 R36.1 R41.1 R42.1 R43.1 R44.1 R49.2 R50.2 R51.2 R53.1 R54.1 R55.1 R56.1 R57.2 R70.1 R75.2 R76.1 R100.1 R102.1 U1.2 U2.3 U2.5 U3.1 U4.8 U4.20 U4.23 U4.35 U4.47 U5.1 U6.1 U8.3 U8.18 U8.29 U9.3 U9.18 U9.29 U10.3 U10.18 U10.29 U11.3 U11.18 U11.29 U15.3 U16.3
VCC: C7.1 C9.2 C18.2 D9.2 J6.1 J6.3 J7.1 J7.3 J8.1 J8.3 J9.1 J9.3 NOREF#15.1 P3.3 P4.3 P7.3 P8.3 P11.3 P12.3 P18.1 P18.2 R37.2 R38.2 R39.2 R40.2 R45.1 R46.1 R47.1 R48.1 R52.1 R81.2 U1.3 U5.3 U6.16 U8.15 U9.15 U10.15 U11.15 U15.5 U16.5
A_LIMT: U4.28
BOOT0: R102.2 U4.44
EXIO: R91.1 U4.46
HOLD: R65.1 U4.39
JP15_2: K1.1 P15.2
MA_DIR: U4.11
MA_STEP: U4.10
MOTOR_EN: R103.1 U4.18 U8.2 U9.2 U10.2 U11.2
MS1: P30.1 R49.1 U8.9 U9.9 U10.9 U11.9
MS2: P30.3 R50.1 U8.10 U9.10 U10.10 U11.10
MS3: P30.5 R51.1 U8.11 U9.11 U10.11 U11.11
MX_1A: P19.3 U8.24
MX_1B: NOREF#50.3 P19.4 U8.21
MX_2A: P19.2 U8.26
MX_2B: NOREF#18.0 P19.1 U8.1
MX_DIR: J7.4 U4.17 U8.19
MX_STEP: J7.2 U4.16 U8.16
MY1_1A: P20.3 U9.24
MY1_1B: NOREF#26.3 P20.4 U9.21
MY1_2A: P20.2 U9.26
MY1_2B: NOREF#41.0 P20.1 U9.1
MY2_1A: P21.2 U10.24
MY2_1B: NOREF#36.3 P21.1 U10.21
MY2_2A: P21.3 U10.26
MY2_2B: NOREF#8.0 P21.4 U10.1
MY_DIR: J8.4 J9.4 U4.15 U9.19 U10.19
MY_STEP: J8.2 J9.2 U4.14 U9.16 U10.16
MZ_1A: P22.2 U11.24
MZ_1B: NOREF#30.3 P22.1 U11.21
MZ_2A: P22.3 U11.26
MZ_2B: NOREF#51.0 P22.4 U11.1
MZ_DIR: J6.4 U4.13 U11.19
MZ_STEP: J6.2 U4.12 U11.16
NETC4_1: C4.1 U3.4
NETC10_1: C10.1 C14.2 D7.1 L2.2 R6.2
NETC17_2: C17.2 P3.1 P4.1 R11.1 R60.2
NETC20_2: C20.2 P7.1 P8.1 R14.1 R61.2
NETC23_1: C23.1 U6.4
NETC25_2: C25.2 P23.1 R90.1 R91.2
NETC26_2: C26.2 P11.1 P12.1 R19.1 R62.2
NETC27_1: C27.1 U6.13
NETC38_1: C38.1 U8.4
NETC38_2: C38.2 U8.5
NETC39_1: C39.1 U9.4
NETC39_2: C39.2 U9.5
NETC40_1: C40.1 U10.4
NETC40_2: C40.2 U10.5
NETC41_1: C41.1 U11.4
NETC41_2: C41.2 U11.5
NETC42_1: C42.1 U8.6
NETC43_1: C43.1 U9.6
NETC44_1: C44.1 U10.6
NETC45_1: C45.1 U11.6
NETC46_1: C46.1 U8.8
NETC47_1: C47.1 U9.8
NETC48_1: C48.1 U10.8
NETC49_1: C49.1 U11.8
NETC54_1: C54.1 U6.7 Y1.2
NETC55_1: C55.1 U6.8 Y1.1
NETC56_1: C56.1 R1.1 R7.2 U3.2
NETC60_2: C60.2 P6.1 R63.2 R66.1
NETC61_2: C61.2 P9.1 R64.2 R67.1
NETC62_2: C62.2 P13.1 R65.2 R68.1
NETD4_1: D4.1 R3.2
NETD5_2: D5.2 L2.1 U2.2
NETD6_2: D6.2 L1.1 U3.3
NETD10_1: D10.1 R4.1
NETD12_1: D12.1 R71.1
NETD12_2: D12.2 U4.38
NETD13_2: D13.2 R76.2
NETD15_1: D15.1 R21.2
NETD16_1: D16.1 R58.2
NETD16_2: D16.2 DZ1.1 P17.2 Q2.2
NETDZ4_2: DZ4.2 Q1.1 Q2.1 Q3.2 R27.1 R57.1 R77.1 R78.1
NETK1_1: P1.2 P1.3 P1.4 P1.5 P1.6 P2.2 P15.1
NETP18_6: P18.6 R22.2
NETP18_8: P18.8 R25.2
NETP30_2: P30.2 P30.4 P30.6 R52.2
NETQ3_1: Q3.1 R80.2 R81.1
NETR6_1: R6.1 R8.2 U2.4
NETR15_1: R15.1 U6.2
NETR16_1: R16.1 U6.3
NETR29_1: R29.1 U8.27
NETR30_2: R30.2 U8.23
NETR31_1: R31.1 U9.27
NETR32_2: R32.2 U9.23
NETR33_1: R33.1 U10.27
NETR34_2: R34.2 U10.23
NETR35_1: R35.1 U11.27
NETR36_2: R36.2 U11.23
NETR37_1: R37.1 R41.3
NETR38_1: R38.1 R42.3
NETR39_1: R39.1 R43.3
NETR40_1: R40.1 R44.3
NETR41_2: R41.2 U8.17
NETR42_2: R42.2 U9.17
NETR43_2: R43.2 U10.17
NETR44_2: R44.2 U11.17
NETR45_2: R45.2 U8.12 U8.14
NETR46_2: R46.2 U9.12 U9.14
NETR47_2: R47.2 U10.12 U10.14
NETR48_2: R48.2 U11.12 U11.14
NETR53_2: R53.2 U8.13
NETR54_2: R54.2 U9.13
NETR55_2: R55.2 U10.13
NETR56_2: R56.2 U11.13
NETR59_1: R59.1 U16.4
NETR80_1: R80.1 U15.4
NRST: C102.2 R104.2 U4.7
PROBE: R63.1 U4.41
PWM: P14.3 P16.3 P25.2 R59.2
RST: C27.2 K2.1 K2.3 P5.1 P18.5 R72.2 U4.42
RUN: R64.1 U4.40
RXD: R15.2 R25.1 U4.31
SPINDLE_PWM: R70.2 U4.29 U15.2 U16.2
SWCLK: P50.3 U4.37
SWDIO: P50.4 U4.34
TXD: R16.2 R22.1 U4.30
USB-CHK: R74.2 R75.1 U4.19
USB_DM: P10.2 U6.6
USB_DP: P10.3 R73.2 U6.5
VUSB: C19.2 D9.1 D13.1 P10.1 R73.1 R74.1 R100.2
X_LIMT: R60.1 U4.25
XTAL1: C22.1 U4.5 Y2.1
XTAL2: C21.1 U4.6 Y2.2
Y_LIMT: R61.1 U4.26
Z_LIMT: R62.1 U4.27

Pads without a net: P18 7; U4 1 2 3 4 21 22 32 33 43 45; U6 9 10 11 12 14 15; U8 7 20 25; U9 7 20 25; U10 7 20 25; U11 7 20 25; U15 1; U16 1

## Via types
v1: diameter 0.5, hole 0.3, Top Layer to Bottom Layer, 597 vias
v2: diameter 0.53, hole 0.3, Top Layer to Bottom Layer, 9 vias

## Routing (per net, layer and track width the routed paths; a pad name or vN(x,y) marks a point on that pad's centre or on a via; arc(x,y) is an arc through that point)
3V3: length 159.6
  Top Layer w0.3: R67.2 90,22.9 v1(90.5,23.4) ; v1(71.2,32.8) 70.5,32.8 68.6,34.7 68.6,37.7 69,38.1 71.5,38.1 ; 103.9,19 100.4,19 100.1,19.3 R72.1 ; R90.2 109.8,19.5 109.3,19 104,19 ; R3.1 R71.2 104,19 ; 93.1,30.8 95.6,30.8 96.65,29.75 U4.48 98.5,27.3 101.6,24.2 104.2,24.2 105.1,23.3 105.1,20.83 104.8,20.53 104.2,20.53 104,20.33 104,19 ; 93.1,30.8 91.15,28.85 U4.36 87.98,27.23 C106.2 85.13,27.23 83.9,26 83.9,22.2 R68.2 85.3,23.4 86.4,23.4 P50.2 ; 93.1,30.8 93.1,32.1 93,32.2 ; 93,32.2 91.15,34.05 U4.24 ; 93,32.2 95.3,32.2 95.95,32.85 U4.9 99.55,32.85 100,33.3 100,38 100.8,38.8 105.2,38.8 R104.1 ; v1(82,38.4) C108.2 87.33,37.27 88.7,35.9 U4.24 ; R103.2 91.15,38.05 U4.24 ; 79.7,33.5 79.3,33.9 75.9,33.9 74.9,32.9 R14.2 ; 79.7,33.5 R11.2 ; 79.7,33.5 79.7,36.2 U5.4 79.7,37.4 v1(79.7,39.1) ; R19.2 v1(76.1,26.3) ; 96.2,22.2 v1(96.2,23.3)
  Top Layer w1: C80.1 71.5,42 71.5,40.1 ; 71.5,40.1 71.5,38.1 72.8,36.8 U5.2 U5.4 ; 71.5,40.1 72.5,41.1 C81.2
  Bottom Layer w0.3: v1(96.2,23.3) 95.3,22.4 91.5,22.4 v1(90.5,23.4) 89.2,23.4 P50.2 ; v1(82,38.4) 80.4,38.4 v1(79.7,39.1) ; v1(71.2,32.8) 71.2,30.5 75.4,26.3 v1(76.1,26.3)
12V: length 178
  Top Layer w0.6: 51.4,63.9 R27.2 v1(52.5,63.8) R77.2 R78.2 ; R1.2 46.65,40.8 46.7,40.85 v1(47.85,40.85)
  Top Layer w1.6: 109.3,28.4 NOREF#14.1 114.3,28.4 117.42,31.52 P14.1 ; 56.3,26.5 56.3,35.6 57,36.3 57,45.3 59.5,47.8 60.7,47.8
  Bottom Layer w0.6: NOREF#16.1 50.9,37.8 v1(47.85,40.85) 42.6,46.1 42.6,62.6 43.9,63.9 52.43,63.9
  Bottom Layer w1.6: P14.1 127.38,31.5 125.1,31.5 125.1,52.4 P24.2 ; NOREF#14.1 110.1,28.4 102.4,36.1 62.9,36.1 61.2,37.8 NOREF#16.1
24V: length 359.4
  Top Layer w0.203: 11.88,74.98 v1(12.4,74.98)
  Top Layer w0.3: 114.94,59.3 114.74,59.1 U11.22 ; 97.66,58.5 97.66,59.3 ; 69.5,58.5 69.5,59.3 ; 83.58,58.5 83.58,59.3 ; 86.78,59.3 86.58,59.1 86.58,58.5 ; U10.22 100.66,59.1 100.86,59.3 ; 72.7,59.3 72.5,59.1 U8.22 ; 111.74,58.5 111.74,59.3
  Top Layer w0.6: 86.83,59.35 89.47,61.99 ; 94.26,63.67 95.19,63.67 95.56,63.3 95.56,61.4 97.53,59.43 ; 83.45,59.43 81.48,61.4 81.48,63.3 81.11,63.67 80.18,63.67 ; 106.5,65.6 C33.1 108.3,65.56 C45.2 ; 100.91,59.35 103.55,61.99 ; 78.03,65.6 C31.1 80.1,65.52 C43.2 ; 72.75,59.35 75.39,61.99 C34.1 75.39,62.4 ; 114.99,59.35 117.63,61.99 ; 65.73,70.35 64.87,69.69 64.87,65.94 65.21,65.6 C30.1 66.1,63.67 67.03,63.67 67.4,63.3 67.4,61.4 69.37,59.43 ; 108.34,63.67 109.27,63.67 109.64,63.3 109.64,61.4 111.61,59.43 ; 92.04,65.6 C32.1 94.2,65.54 C44.2
  Top Layer w1: P16.1 126.44,20.1 C12.1 120,18.6 P27.1
  Top Layer w1.2: 65.73,70.35 66.09,70.7 ; 75.31,62.32 77.76,64.77 78.03,65.6 ; 103.55,62.4 103.81,62.4 106.5,65.09 ; 106.5,65.6 106.5,70.35 ; 92.04,65.4 91.84,64.77 89.42,62.35 ; 78.06,65.7 78.06,70.35 ; 92.04,65.6 92.04,70.35
  Top Layer w1.3: C13.1 54.4,37.9 49.2,32.7 D7.2 ; 53.77,39.4 53.77,43.78 52.4,45.15
  Top Layer w1.6: 17.4,72.4 P17.1 17.4,65.03 DZ1.2
  Top Layer w2: NOREF#5.0 119.35,70.75 121,69.1 121,64.19 119.01,62.19 122.8,58.4 NOREF#52.1
  Bottom Layer w0.381: v1(15.07,70.47) 12.4,73.13 v1(12.4,74.98)
  Bottom Layer w1.2: 124.74,21.06 125.3,21.06
  Bottom Layer w1.6: 17.4,72.8 16.8,72.2 P17.1
  Bottom Layer w2: 53.9,40.52 61.02,40.52 64.9,44.4 64.9,69.51 65.73,70.35 ; NOREF#52.1 122.8,23.56 125.3,21.06 P16.1 ; 65.73,70.35 NOREF#5.0 65.73,71.77 62.5,75 19.6,75 17.4,72.8 P17.1 ; 65.73,70.35 65.73,70.23 ; 16.8,72.2 v1(15.07,70.47) 14.35,69.75 14.35,62.78 12.1,60.53 P1.1
48V1: length 1.9
  Top Layer w0.3: 19.4,56.3 R4.2
48V_IN: length 60.6
  Top Layer w0.3: v1(40.6,68.5) R21.1
  Top Layer w2: 33.3,68.9 27.8,68.9 26.2,70.5 P2.1 ; 33.3,68.9 30.67,66.27 DZ2.2 ; 33.3,68.9 P2.3
  Bottom Layer w0.3: v1(40.6,68.5) 39.5,68.5 P2.3
  Bottom Layer w2: 17.2,48.58 NOREF#17.1 17.2,52.8 P2.3
48V_SPN-: length 19.5
  Top Layer w0.3: D15.2 42.68,70.42 41.59,71.5 ; D17.2 58.64,70.64 Q1.2
  Top Layer w2: DZ2.1 37.53,68.03 41.32,71.82
GND: length 130.3
  Top Layer w0.3: U9.18 NOREF#23.5 84.58,56.5 U9.3 ; 97.9,25.7 96.6,25.7 96.15,26.15 U4.47 ; 97.9,25.7 99.3,25.7 101.3,23.7 103.5,23.7 104.1,23.1 104.1,22.07 103.97,22.07 102.4,20.5 R102.1 ; 97.9,25.7 v1(97.9,26.3) ; C106.1 86.87,28.6 v1(87.8,28.6) 88.55,29.35 U4.35 ; v1(82.4,23.3) 82,22.9 C62.1 ; v1(96.1,31.9) 96.55,32.35 U4.8 ; 92,34.2 92.8,34.2 93.15,34.55 U4.20 ; 92,34.2 91.65,34.55 U4.23 ; 92,34.2 93.3,32.9 94.4,32.9 v1(95,33.5) ; C46.2 70.37,46.83 69.59,47.6 69.59,49 v1(68.8,49.79) ; U16.3 111.55,20.55 111.1,21 111.1,22.9 110.6,23.4 C24.2 ; v1(95.8,53.4) 95.8,51.03 97.8,49.03 97.8,47.63 98.57,46.85 ; 76.66,25.3 76.9,25.06 76.9,24 74.88,21.97 74.88,22.3 ; C61.1 88,22.46 P50.1 ; 81.9,51.7 81.9,51.9 ; 81.9,51.7 81.9,50.85 83.17,49.57 ; 81.9,51.7 v1(81.9,53.2) ; U11.3 112.74,56.5 NOREF#20.5 U11.18 ; 84.49,46.85 83.72,47.63 83.72,49.03 83.17,49.57 ; U6.1 41.99,30.11 40.9,31.2 39.1,31.2 38.83,30.93 C23.2 36.3,29.9 34.3,27.9 34.3,26.4 34.9,25.8 C54.2 C55.2 ; v1(110.1,53.3) 110.1,50.81 111.88,49.03 111.88,47.63 112.65,46.85 ; U10.3 98.66,56.5 NOREF#34.5 U10.18 ; 94.2,22.07 v1(94.2,23.3) ; 83.17,49.57 82.93,49.82 ; DZ4.1 42.8,65.5 R57.2 44.7,64 Q3.3 ; 79.68,28.4 79.68,28.28 78.1,26.7 R70.1 76.07,28.33 v1(76.07,28.4) 74.88,28.4 ; U8.18 NOREF#3.5 70.5,56.5 U8.3
  Top Layer w0.6: C18.1 16.6,26.11 v1(17.41,26.11) ; v1(17.03,20.4) 16.18,20.4 C19.1 ; R76.1 26.39,22.02 26.59,21.82 26.64,21.82 26.67,21.8 v1(27.41,21.8) ; v1(20.66,19.4) 20.56,19.5 20.56,19.57 19.88,20.25 R100.1 ; 14.15,58.18 D10.2 ; v1(27.46,20.35) 26.45,20.35 R75.2
  vias: v1(1.59,66.86) v1(1.8,70.3) v1(1.8,69.6) v1(2.29,66.86) v1(2.5,70.3) v1(2.5,69.6) v1(2.99,66.86) v1(10.1,30.5) v1(10.1,29.7) v1(10.9,30.5) v1(10.9,29.7) v1(11.7,30.5) v1(11.7,29.7) v1(12.5,30.5) v1(12.5,29.7) v1(27.5,42.7) v1(27.6,41.9) v1(28.3,42.7) v1(28.4,41.9) v1(29.1,42.7) v1(29.2,41.9) v1(29.9,42.7) v1(30,41.9) v1(30.46,24.6) v1(30.46,23.8) v1(30.7,58.1) v1(30.7,57.3) v1(30.7,56.5) v1(30.7,53.4) v1(30.7,52.6) v1(30.69,51.81) v1(30.69,51.01) v1(30.69,50.21) v1(31.26,24.6) v1(31.26,23.8) v1(31.5,58.1) v1(31.5,57.3) v1(31.5,56.5) v1(31.5,53.4) v1(31.5,52.6) v1(31.49,51.81) v1(31.49,51.01) v1(31.49,50.21) v1(32.06,24.6) v1(32.06,23.8) v1(32.86,24.6) v1(32.86,23.8) v1(35.2,48.6) v1(35.2,47.8) v1(36,48.6) v1(36,47.8) v1(36.8,48.6) v1(36.8,47.8) v1(37.6,48.6) v1(37.6,47.8) v1(38.4,48.6) v1(38.4,47.8) v1(39.2,48.6) v1(39.2,47.8) v1(40,48.6) v1(40,47.8) v1(40.3,40.6) v1(40.3,39.8) v1(40.3,39) v1(40.3,36.2) v1(40.3,35.4) v1(40.3,34.6) v1(40.8,48.6) v1(40.8,47.8) v1(41.1,40.6) v1(41.1,39.8) v1(41.1,39) v1(41.1,36.2) v1(41.1,35.4) v1(41.1,34.6) v1(41.6,48.6) v1(41.6,47.8) v1(43.4,39.1) v1(43.4,38.3) v1(44.1,66.2) v1(44.1,65.4) v1(44.2,39.1) v1(44.2,38.3) v1(44.9,66.2) v1(44.9,65.4) v1(45,39.1) v1(45,38.3) v1(45.7,66.2) v1(45.7,65.4) v1(45.8,39.1) v1(45.8,38.3) v1(46.5,66.2) v1(46.5,65.4) v1(46.6,39.1) v1(46.6,38.3) v1(54.4,34.18) v1(54.4,33.38) v1(54.4,32.58) v1(54.4,31.78) v1(54.4,30.98) v1(58.3,73.4) v1(58.3,72.6) v1(58.5,35.9) v1(58.5,35.1) v1(58.5,34.3) v1(58.5,33.5) v1(59.1,73.4) v1(59.1,72.6) v1(59.3,35.9) v1(59.3,35.1) v1(59.3,34.3) v1(59.3,33.5) v1(59.3,25.8) v1(59.3,25) v1(59.3,24.2) v1(59.3,23.4) v1(59.9,73.4) v1(59.9,72.6) v1(60.1,34.3) v1(60.1,33.5) v1(60.1,25.8) v1(60.1,25) v1(60.1,24.2) v1(60.1,23.4) v1(60.6,71.6) v1(60.6,70.8) v1(60.6,70) v1(60.7,73.4) v1(60.7,72.6) v1(60.9,34.3) v1(60.9,33.5) v1(61.4,71.6) v1(61.4,70.8) v1(61.4,70) v1(61.7,34.3) v1(61.7,33.5) v1(62.5,34.3) v1(62.5,33.5) v1(63,65) v1(63.6,40.5) v1(63.6,39.7) v1(63.6,38.9) v1(63.6,38.1) v1(64.4,40.5) v1(64.4,39.7) v1(64.4,38.9) v1(64.4,38.1) v1(65.6,40.5) v1(65.6,39.7) v1(65.6,38.9) v1(65.6,38.1) v1(66.4,40.5) v1(66.4,39.7) v1(66.4,38.9) v1(66.4,38.1) v1(75,45.41) v1(75.3,39.4) v1(75.3,38.6) v1(76.1,39.4) v1(76.1,38.6) v1(76.62,68.45) v1(76.62,67.65) v1(76.62,66.85) v1(76.62,66.05) v1(76.59,65.3) v1(76.9,39.4) v1(76.9,38.6) v1(77.2,59.81) v1(78,59.81) v1(78.4,74.93) v1(78.4,74.13) v1(78.4,73.33) v1(78.4,72.53) v1(78.8,59.81) v1(85.4,45.5) v1(89.9,65.29) v1(90.39,47.1) v1(90.7,68.45) v1(90.7,67.65) v1(90.7,66.85) v1(90.7,66.05) v1(90.67,65.3) v1(91.1,74.98) v1(91.1,74.18) v1(91.1,73.38) v1(91.1,72.58) v1(91.39,59.8) v1(92.19,59.8) v1(92.99,59.8) v1(99.2,15.5) v1(103.98,65.29) v1(104.78,68.45) v1(104.78,67.65) v1(104.78,66.85) v1(104.78,66.05) v1(104.75,65.3) v1(105.49,59.8) v1(106.29,59.8) v1(106.47,47.6) v1(107.09,59.8) v1(107.1,25.9) v1(107.1,25.1) v1(107.1,24.3) v1(107.1,23.5) v1(107.9,25.9) v1(107.9,25.1) v1(107.9,24.3) v1(107.9,23.5) v1(117.26,65.29) v1(118.06,65.29) v1(118.5,58.85) v1(118.5,58.05) v1(118.5,57.25) v1(118.5,56.45) v1(118.83,65.3) v1(118.86,68.45) v1(118.86,67.65) v1(118.86,66.85) v1(118.86,66.05) v1(119.3,58.85) v1(119.3,58.05) v1(119.3,57.25) v1(119.3,56.45) v1(119.4,47.5) v1(120.1,58.85) v1(120.1,58.05) v1(120.1,57.25) v1(120.1,56.45) v2(74.81,16.3) v2(74.81,15.7) v2(89.5,37.8) v2(108.5,36.63) v2(108.46,34.7)
VCC: length 350.9
  Top Layer w0.3: 114.84,44.84 114.8,44.88 R48.1 ; 114.84,44.84 111.94,44.84 111.4,44.3 J6.3 111.4,42.68 110.52,41.8 105.5,41.8 104.73,42.57 R39.2 102.83,43.9 102.23,44.5 ; 114.84,44.84 116.28,43.4 116.78,43.9 118.8,43.9 ; v1(88.2,50) 88.2,51 87.58,51.62 87.58,54.4 ; 90.67,43.9 88.64,43.9 J7.1 ; 90.67,43.9 90.7,43.87 ; 90.67,43.9 90.67,42.93 91.41,42.19 93.01,42.19 93.63,42.8 97.15,42.8 ; R81.2 58.5,65.1 61.5,65.1 62.1,64.5 62.1,63 61.15,62.05 U15.5 61.55,61.2 63.4,61.2 63.9,60.7 63.9,46.2 65.9,44.2 67.9,44.2 ; R46.1 86.7,46.6 88.14,45.16 J7.1 ; J6.1 114.78,41.7 112.6,41.7 109.5,38.6 R52.1 ; v1(74.1,50) 74.1,51.1 73.5,51.7 73.5,54.4 ; 109.5,37.7 109.6,37.8 ; U1.3 55.8,24.4 53.6,26.6 53.6,31 52.9,31.7 51,31.7 49.41,30.11 U6.16 ; 97.15,41.75 97.3,41.6 ; 97.15,41.75 J9.3 ; 97.15,41.75 97.15,42.8 ; J7.1 86.38,41.64 77.66,41.64 76.6,42.7 R37.2 75.5,43.9 v1(74,45.4) R45.1 ; 83.06,41.66 J7.3 ; 67.9,44.2 v1(72.3,44.2) ; 67.9,44.2 67.9,34.2 v1(68,34.1) ; U16.5 114.95,22.45 114.4,21.9 114.4,19.6 112.9,18.1 112.9,12.9 110.5,10.5 103,10.5 102.4,11.1 102.4,16.8 101.5,17.7 79.9,17.7 P18.2 ; 102.18,41.4 102.23,41.45 J9.1 102.23,42.7 102.13,42.8 97.15,42.8 ; v1(102.7,49.9) 102.7,50.6 101.66,51.64 101.66,54.4 ; v1(116.6,49.9) 116.6,50.7 115.74,51.56 115.74,54.4 ; R47.1 100.7,46.03 102.23,44.5 ; 101.96,44.5 102.23,44.5 ; 102.23,44.5 102.23,42.98
  Top Layer w0.6: v1(37.1,20.2) 32.07,20.2 27.57,24.7 16.74,24.7 C18.2 14.83,24.43 D9.2 ; P3.3 P4.3 P7.3 P8.3 P11.3 P12.3 ; 70.9,35.6 v1(72.4,34.1) 73.2,34.1 U5.3 ; NOREF#15.1 54.8,23.06 U1.3
  Top Layer w1: C9.2 56.63,23.23 U1.3 ; 55.54,23.8 55.56,23.8
  Bottom Layer w0.3: 116.28,43.4 116.34,43.46 ; v1(72.3,44.2) 72.8,44.2 v1(74,45.4) ; J6.1 116.6,43.52 v1(116.6,49.9) ; J7.1 88.18,43.44 88.18,50 ; J9.3 J8.3 ; 74.1,45.5 v1(74.1,50) ; v1(102.7,49.9) 102.23,49.43 J8.1
  Bottom Layer w0.6: v1(37.1,20.2) 39.56,17.74 P3.3 ; P7.3 54.8,19.94 NOREF#15.1 54.8,23.18 65.72,34.1 v1(68,34.1) v1(72.4,34.1) ; P18.1 P18.2 77.06,17.74 P12.3
BOOT0: length 10.4
  Top Layer w0.3: U4.44 94.65,25.95 95.5,25.1 99.1,25.1 R102.2
EXIO: length 16.7
  Top Layer w0.3: R91.1 106.2,23.3 v1(104.9,24.6) ; U4.46 v1(95.65,29.65)
  Bottom Layer w0.3: v1(95.65,29.65) 98.75,29.65 103.8,24.6 v1(104.9,24.6)
HOLD: length 9.7
  Top Layer w0.3: U4.39 92.15,26.2 91.85,25.9 89.3,25.9 89,25.6 89,24.3 88.4,23.7 87.6,23.7 R65.1
MOTOR_EN: length 120.8
  Top Layer w0.3: U10.2 95,57 93.3,55.3 93.3,47.3 93.8,46.8 v1(93.8,45.97) ; U11.2 109.8,57 107.4,54.6 107.4,47.7 ; 107.4,47.4 107.4,47.7 ; 107.4,47.7 107.4,47.3 107.8,46.9 v1(107.8,44.62) ; 67.2,57 67.4,57 ; 67.4,57 U8.2 ; 67.4,57 66.8,57 65.1,55.3 65.1,46.9 66.4,45.6 72.8,45.6 77.5,40.9 v1(79.3,40.9) v2(93.2,40.9) 93.5,40.9 94,40.4 107,40.4 v1(107.5,40.9) ; U4.18 94.15,37.25 93.75,37.65 ; R103.1 93.1,38.4 v1(93.8,37.7) ; v1(79.7,44.8) 79.7,46.8 79.3,47.2 79.3,54.5 81.8,57 U9.2
  Bottom Layer w0.3: v1(107.8,44.62) 107.5,44.32 v1(107.5,40.9) ; v1(93.8,37.7) 93.2,38.3 v2(93.2,40.9) 93.2,45.37 v1(93.8,45.97) ; v1(79.3,40.9) 79.3,44.4 v1(79.7,44.8)
MS1: length 87.8
  Top Layer w0.3: v1(97.56,52.3) 98.16,52.9 U10.9 ; U11.9 112.24,52.9 v1(111.64,52.3) ; R49.1 114.2,31.6 118,35.4 118,37.76 P30.1 ; U8.9 70,52.9 v1(69.4,52.3) ; v1(83.48,52.3) 84.08,52.9 U9.9
  Bottom Layer w0.3: P30.1 121.7,41.46 121.7,51.7 120.7,52.7 114.6,52.7 114.2,52.3 v1(111.64,52.3) 105.7,52.3 104.6,53.4 100.5,53.4 99.4,52.3 v1(97.56,52.3) 95.2,52.3 94.2,53.3 87.2,53.3 86.2,52.3 v1(83.48,52.3) 79.2,52.3 77.9,53.6 73.3,53.6 72,52.3 v1(69.4,52.3)
MS2: length 86.3
  Top Layer w0.3: v1(98.26,51.6) 98.66,52 U10.10 ; U11.10 112.74,52 v1(112.34,51.6) ; P30.3 115.5,37.8 115.5,35.8 113.4,33.7 R50.1 ; U9.10 84.58,52 v1(84.18,51.6) ; v1(70.1,51.6) 70.5,52 U8.10
  Bottom Layer w0.3: P30.3 121.1,43.4 121.1,51.4 120.4,52.1 114.9,52.1 114.4,51.6 v1(112.34,51.6) 105.6,51.6 104.3,52.9 100.85,52.9 99.55,51.6 v1(98.26,51.6) 95.1,51.6 93.9,52.8 87.5,52.8 86.3,51.6 v1(84.18,51.6) 79.1,51.6 77.6,53.1 73.7,53.1 72.2,51.6 v1(70.1,51.6)
MS3: length 85.4
  Top Layer w0.3: v1(70.8,50.9) 71,51.1 U8.11 ; R51.1 114.26,38.96 P30.5 ; U10.11 99.16,51.1 v1(98.96,50.9) ; v1(84.88,50.9) 85.08,51.1 U9.11 ; U11.11 113.24,51.1 v1(113.04,50.9)
  Bottom Layer w0.3: v1(70.8,50.9) 72.3,50.9 74,52.6 77.2,52.6 78.9,50.9 v1(84.88,50.9) 86.4,50.9 87.8,52.3 93.5,52.3 94.9,50.9 v1(98.96,50.9) 99.7,50.9 101.2,52.4 104,52.4 105.5,50.9 v1(113.04,50.9) 114.6,50.9 115.3,51.6 120.1,51.6 120.5,51.2 120.5,43.7 117.5,40.7 115.1,40.7 114.26,39.86 P30.5
MX_1A: length 19.6
  Top Layer w0.3: U8.24 v1(71.5,60.9)
  Bottom Layer w0.8: v1(71.5,60.9) 71.5,60.2 71,59.7 69.7,59.7 69,60.4 69,70.5 70.02,71.52 P19.3
MX_1B: length 29.8
  Top Layer w0.3: 74.3,57.7 74.1,57.5 U8.21
  Top Layer w0.6: 74.31,57.81 NOREF#50.3
  Bottom Layer w0.8: P19.4 67.48,74.48 68.3,75.3 76.4,75.3 76.8,74.9 76.8,71.4 74.31,68.91 NOREF#50.3
MX_2A: length 15.9
  Top Layer w0.3: U8.26 v1(70.5,60.9)
  Bottom Layer w0.8: v1(70.5,60.9) 70.5,70 72.56,72.06 P19.2
MX_2B: length 21.8
  Top Layer w0.3: U8.1 68.1,57.5 67.75,57.85
  Top Layer w0.6: 67.75,57.85 NOREF#18.0
  Bottom Layer w0.8: P19.1 75.1,72.3 72.78,69.98 72.78,59.58 71.5,58.3 NOREF#18.0
MX_DIR: length 37.5
  Top Layer w0.3: 76,54 76,54.6 ; 76,54.6 74.1,56.5 U8.19 ; 76,54.6 v1(76,50.8) ; U4.17 94.65,37.95 93.08,39.52 81.98,39.52 v1(81.3,40.2)
  Bottom Layer w0.3: v1(76,50.8) 77.1,50.8 80.52,47.38 J7.4 80.52,40.98 v1(81.3,40.2)
MX_STEP: length 34.6
  Top Layer w0.3: v1(74.5,51.9) 74.5,54.52 74.03,55 U8.16 ; U4.16 95.15,38.35 93.3,40.2 v1(85.6,40.2) 85.6,40.1
  Bottom Layer w0.3: v1(74.5,51.9) 77.1,51.9 J7.2 v1(85.6,40.2) 85.6,40.1
MY1_1A: length 19
  Top Layer w0.3: U9.24 v1(85.58,60.9)
  Bottom Layer w0.8: v1(85.58,60.9) 85.58,60.28 85.1,59.8 84,59.8 82.8,61 P20.3
MY1_1B: length 29.4
  Top Layer w0.3: 88.38,57.7 88.18,57.5 U9.21
  Top Layer w0.6: 88.39,57.81 NOREF#26.3
  Bottom Layer w0.8: P20.4 80.26,74.66 80.9,75.3 89.1,75.3 89.7,74.7 89.7,71.3 88.39,69.99 NOREF#26.3
MY1_2A: length 15.3
  Top Layer w0.3: U9.26 v1(84.58,60.9)
  Bottom Layer w0.8: P20.2 85.34,71.84 84.58,71.08 v1(84.58,60.9)
MY1_2B: length 21.1
  Top Layer w0.3: U9.1 82.18,57.5 81.83,57.85
  Top Layer w0.6: 81.83,57.85 NOREF#41.0
  Bottom Layer w0.8: P20.1 87.88,71.48 86.86,70.46 86.86,59.86 85.3,58.3 NOREF#41.0
MY2_1A: length 15.6
  Top Layer w0.3: U10.24 v1(99.66,60.9)
  Bottom Layer w0.8: v1(99.66,60.9) 99.66,62.44 98.1,64 P21.2
MY2_1B: length 17.3
  Top Layer w0.3: 102.46,57.7 102.26,57.5 U10.21
  Top Layer w0.6: 102.47,57.81 NOREF#36.3
  Bottom Layer w0.8: P21.1 102.47,71.67 NOREF#36.3
MY2_2A: length 16.3
  Top Layer w0.3: U10.26 v1(98.66,60.9)
  Bottom Layer w0.8: P21.3 95.56,64 v1(98.66,60.9)
MY2_2B: length 17.7
  Top Layer w0.3: 95.91,57.85 96.26,57.5 U10.1
  Top Layer w0.6: 95.91,57.85 NOREF#8.0
  Bottom Layer w0.8: NOREF#8.0 95.91,61.59 93.02,64.48 P21.4
MY_DIR: length 53
  Top Layer w0.3: 90.08,54.2 90.08,50.98 v1(90,50.9) ; 90.08,54.2 90.08,54.6 88.18,56.5 U9.19 ; 90.08,54.2 90.08,54 ; v1(100.9,43.7) 100.6,43.4 95.81,43.4 J8.4 ; v1(104.1,51.1) 104.1,54.66 102.26,56.5 U10.19 ; U4.15 95.65,38.45 v1(95.9,38.7)
  Bottom Layer w0.3: J9.4 95.05,41.16 ; J9.4 94.61,41.4 ; J9.4 95.9,40.31 v1(95.9,38.7) ; J9.4 J8.4 94.61,49.47 93.18,50.9 v1(90,50.9) ; v1(104.1,51.1) 105.3,49.9 105.3,45.2 103.2,43.1 101.5,43.1 v1(100.9,43.7)
MY_STEP: length 39.5
  Top Layer w0.3: v1(98.2,39.4) 96.15,37.35 U4.14 ; v1(88.6,51.6) 88.58,51.62 88.58,54.52 88.1,55 U9.16 ; v1(102.6,51.7) 102.66,51.76 102.66,54.2 ; 102.66,54.2 102.66,54.52 102.19,55 U10.16 ; 102.66,54.2 102.66,54
  Bottom Layer w0.3: v1(88.6,51.6) 93.3,51.6 96.81,48.09 99.69,48.09 ; J9.2 99.8,41.49 ; J9.2 99.69,40.89 v1(98.2,39.4) ; J9.2 J8.2 99.69,48.09 ; 99.69,48.09 102.6,51 v1(102.6,51.7)
MZ_1A: length 16.2
  Top Layer w0.3: U11.24 v1(113.74,60.9)
  Bottom Layer w0.8: P22.2 110.88,72.07 113.74,69.21 v1(113.74,60.9)
MZ_1B: length 17.9
  Top Layer w0.3: 116.54,57.7 116.34,57.5 U11.21
  Top Layer w0.6: 116.55,57.81 NOREF#30.3
  Bottom Layer w0.8: P22.1 113.42,71.6 115.3,69.72 115.3,59.5 NOREF#30.3
MZ_2A: length 16.8
  Top Layer w0.3: U11.26 v1(112.74,60.9)
  Bottom Layer w0.8: v1(112.74,60.9) 112.4,61.24 112.4,68.45 108.34,72.51 P22.3
MZ_2B: length 18.3
  Top Layer w0.3: U11.1 110.34,57.5 109.99,57.85
  Top Layer w0.6: 109.99,57.85 NOREF#51.0
  Bottom Layer w0.8: P22.4 105.8,73 109.99,68.81 NOREF#51.0
MZ_DIR: length 44.5
  Top Layer w0.3: U4.13 96.64,35.91 96.64,36.84 99.6,39.8 107.82,39.8 v1(108.86,40.84) ; v1(119.6,50.8) 118.24,52.16 118.24,54.6 ; 118.24,54.6 118.24,54 ; 118.24,54.6 116.34,56.5 U11.19
  Bottom Layer w0.3: 108.86,41.3 117.3,41.3 118.4,42.4 118.4,49.6 v1(119.6,50.8) ; 108.86,41.3 J6.4 ; 108.86,41.3 v1(108.86,40.84)
MZ_STEP: length 40.8
  Top Layer w0.3: U4.12 98.2,37.4 100.1,39.3 109.2,39.3 113.3,43.4 J6.2 ; U11.16 116.26,55 116.74,54.52 ; 116.74,54.52 116.74,54 ; 116.74,54.52 116.74,51.46 117.4,50.8 v1(117.4,50.6)
  Bottom Layer w0.3: J6.2 113.94,42.36 114.42,41.88 117.08,41.88 117.8,42.6 117.8,50.2 v1(117.4,50.6)
NETC4_1: length 6.7
  Top Layer w0.3: 54.3,46.3 52.9,47.7 50.7,47.7 50.2,47.2 U3.4
NETC10_1: length 11.1
  Top Layer w0.6: C10.1 35.4,39.7 37.7,42 R6.2
  Top Layer w2: 37.36,32.7 D7.1
NETC17_2: length 59.1
  Top Layer w0.3: R11.1 v2(78.1,31.4) 78.1,28.42 C17.2 ; v1(71.9,31.4) 71.6,31.1 71.6,21.5 72.6,20.5 72.6,17.3 71.8,16.5 50.34,16.5 P4.1 P3.1
  Bottom Layer w0.3: v1(71.9,31.4) v2(78.1,31.4)
NETC20_2: length 39.8
  Top Layer w0.3: R14.1 R61.2 73.3,28.42 ; 73.3,28.42 72.2,27.33 72.2,21.6 73.2,20.6 73.2,15.1 72,13.9 59.94,13.9 P8.1 P7.1 ; 73.3,28.42 C20.2
NETC23_1: length 5.4
  Top Layer w0.3: U6.4 41.4,26.3 40.37,27.33 C23.1
NETC25_2: length 83.2
  Top Layer w0.3: v1(114.5,18.6) 113.6,17.7 113.6,12.9 114.4,12.1 117.1,12.1 117.6,12.6 117.6,14.5 122.1,19 127.9,19 129.4,20.5 129.4,55.76 P23.1 122.93,62.23 C25.2 ; R91.2 v1(107.2,20.5) R90.1
  Bottom Layer w0.3: v1(107.2,20.5) 109.1,18.6 v1(114.5,18.6)
NETC26_2: length 22.1
  Top Layer w0.3: R19.1 R62.2 73.3,22.33 C26.2 73.9,21.73 73.9,14.2 72.36,12.66 P12.1 P11.1
NETC27_1: length 5.2
  Top Layer w0.3: C27.1 50.83,23.57 50.4,24 50.4,25.4 49.5,26.3 U6.13
NETC38_1: length 13.9
  Top Layer w0.3: C38.1 66.19,46.83 65.8,47.21 65.8,55.1 66.7,56 U8.4
NETC38_2: length 10.1
  Top Layer w0.3: C38.2 67.33,48.37 66.8,48.9 66.8,55.1 67.2,55.5 U8.5
NETC39_1: length 13.3
  Top Layer w0.3: U9.4 81.5,56 79.9,54.4 79.9,47.5 80.57,46.83 C39.1
NETC39_2: length 9.9
  Top Layer w0.3: C39.2 81.23,48.37 80.88,48.72 80.88,54.58 81.8,55.5 U9.5
NETC40_1: length 14
  Top Layer w0.3: U10.4 94.86,56 93.96,55.1 93.96,47.54 94.67,46.83 ; 94.67,46.83 C40.1 ; 94.67,46.83 94.96,46.83
NETC40_2: length 10.3
  Top Layer w0.3: U10.5 95.3,55.5 94.8,55 94.8,48.9 95.33,48.37 C40.2
NETC41_1: length 13.3
  Top Layer w0.3: U11.4 109.5,56 108.04,54.54 108.04,47.66 108.87,46.83 C41.1
NETC41_2: length 10.2
  Top Layer w0.3: U11.5 109.7,55.5 108.8,54.6 108.8,49.1 109.53,48.37 C41.2
NETC42_1: length 9.3
  Top Layer w0.3: 67.5,54.7 v1(67.4,54.7) 67.7,55 U8.6 ; v1(66.5,60.8) 66.1,61.2 66.1,62.13
  Bottom Layer w0.3: v1(66.5,60.8) 66.5,58 67.4,57.1 v1(67.4,54.7)
NETC43_1: length 10.5
  Top Layer w0.3: 80.18,62.13 80.18,61.2 v1(80.58,60.8) ; U9.6 81.97,55 81.58,54.6 v1(81.58,54.1)
  Bottom Layer w0.3: v1(80.58,60.8) 80.58,58 81.48,57.1 81.48,54.9 ; v1(81.58,54.1) 81.48,54.2 81.48,54.9 ; 81.48,54.9 81.48,54.7
NETC44_1: length 9.3
  Top Layer w0.3: 95.66,54.7 v1(95.56,54.7) 95.86,55 U10.6 ; v1(94.66,60.8) 94.26,61.2 94.26,62.13
  Bottom Layer w0.3: v1(95.56,54.7) 95.56,57.1 94.66,58 v1(94.66,60.8)
NETC45_1: length 10
  Top Layer w0.3: 108.34,62.13 108.34,61.2 v1(108.74,60.8) ; v1(109.64,54.3) 109.64,54.7 109.94,55 U11.6
  Bottom Layer w0.3: v1(108.74,60.8) 108.74,58 109.64,57.1 v1(109.64,54.3)
NETC46_1: length 6.5
  Top Layer w0.3: C46.1 70.6,49.19 68.7,51.09 68.7,53.1 69.1,53.5 69.5,53.5
NETC47_1: length 6.4
  Top Layer w0.3: 83.58,53.5 83.18,53.5 82.78,53.1 82.78,51.09 84.68,49.19 ; C47.1 84.68,49.07
NETC48_1: length 6.5
  Top Layer w0.3: 97.66,53.5 97.26,53.5 96.86,53.1 96.86,51.09 98.76,49.19 C48.1
NETC49_1: length 6.4
  Top Layer w0.3: C49.1 112.84,49.15 ; 111.74,53.5 111.34,53.5 110.94,53.1 110.94,51.09 112.84,49.19
NETC54_1: length 10.6
  Top Layer w0.3: U6.7 41.51,22.49 39,25 Y1.2 38.85,27.35 35.8,27.35
NETC55_1: length 7.3
  Top Layer w0.3: U6.8 39.71,21.19 Y1.1 35.93,21.9 C55.1
NETC56_1: length 11.4
  Top Layer w0.6: R7.2 44.3,48 46.2,48 46.8,47.4 U3.2 46.8,42.5 C56.1 R1.1
NETC60_2: length 84
  Top Layer w0.3: 46,10.32 25.48,10.32 23.07,12.73 P6.1 ; 46,10.32 46.3,10.32 ; 46,10.32 46.1,10.42 73.52,10.42 76.9,13.8 76.9,17.2 78.2,18.5 92.7,18.5 94.1,19.9 C60.2 94.12,20.5 R66.1 R63.2
NETC61_2: length 71.1
  Top Layer w0.3: R64.2 R67.1 88.03,20.5 C61.2 88,19.9 87.2,19.1 78,19.1 76.3,17.4 76.3,14.1 73.1,10.9 29.9,10.9 28.1,12.7 P9.1
NETC62_2: length 58
  Top Layer w0.3: P13.1 35.53,11.4 72.5,11.4 75.7,14.6 75.7,17.7 77.6,19.6 81.07,19.6 C62.2 85.97,20.53 R65.2
